# Altium schematic sheet halfBridge.SchDoc
size A
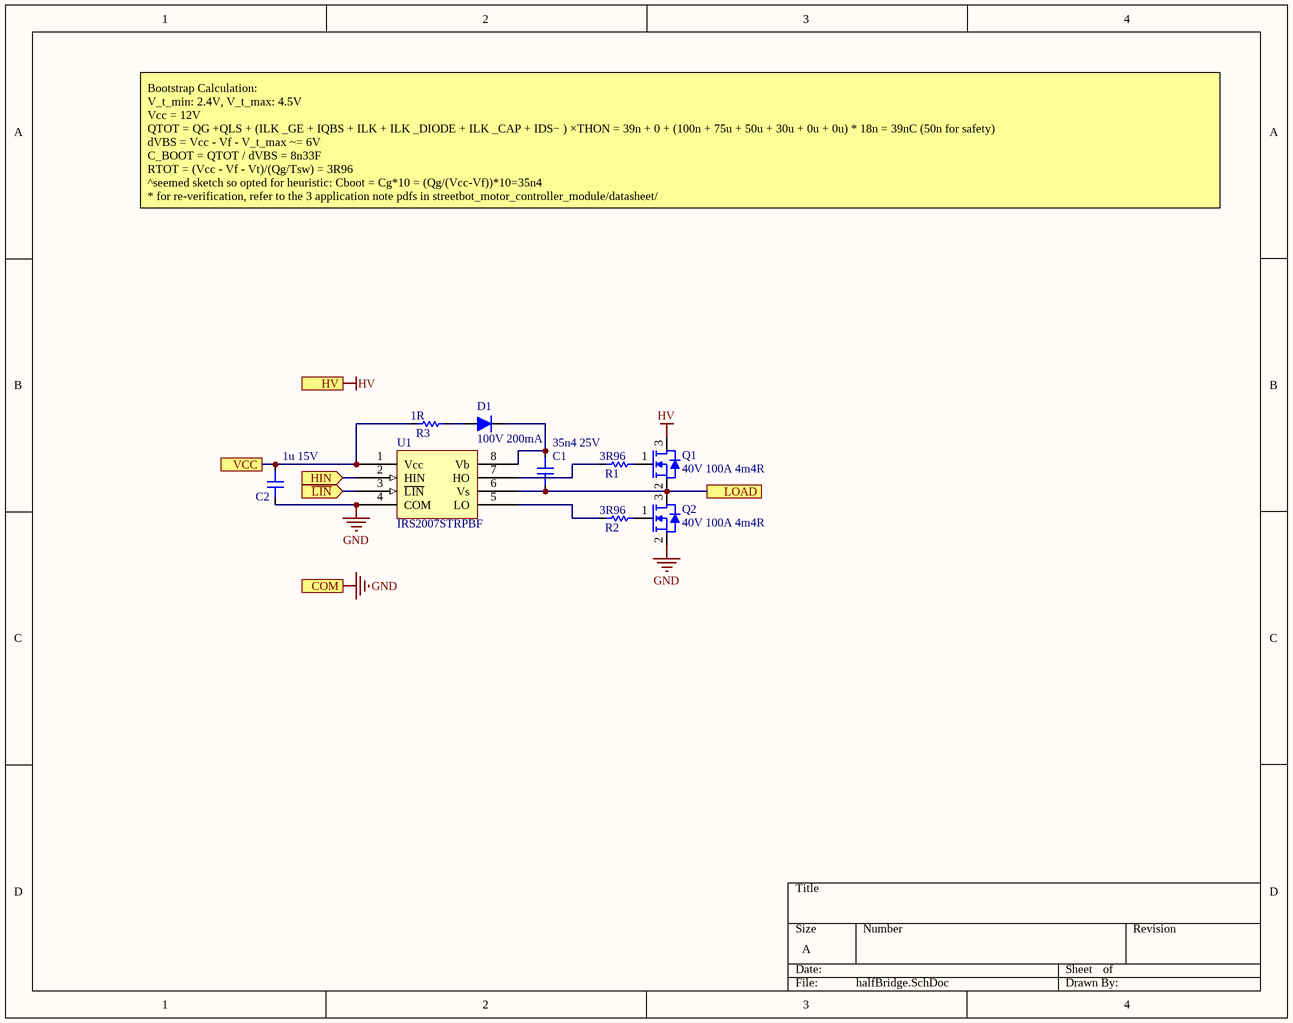
[diagram p0: halfBridge.SchDoc]

## Parts
C1  35n4 25V  [CAP 0805 L]
C2  1u 15V  [CAP 0805 L]
D1  100V 200mA  [SODFL250X100-2M]
Q1  40V 100A 4m4R  [DPAK127P600X120-5M (LFPAK56; Power-SO8)]
Q2  40V 100A 4m4R  [DPAK127P600X120-5M (LFPAK56; Power-SO8)]
R1  3R96  [RES 0603 L]
R2  3R96  [RES 0603 L]
R3  1R  [RES 0603 L]
U1  IRS2007STRPBF  [SOIC-8]

## Ports
COM, HIN (in), HV, LOAD, VCC, ~{LIN} (in)

## Nets
GND: C2.1 Q2.2 U1.4(COM) ; port COM
HV: Q1.3 ; port HV
HIN: U1.2(HIN) ; port HIN
~{LIN}: U1.3(~{LIN}) ; port ~{LIN}
LOAD: C1.1 Q1.2 Q2.3 U1.6(Vs) ; port LOAD
VCC: C2.2 R3.1 U1.1(Vcc) ; port VCC
NetC1_2: C1.2 D1.2 U1.8(Vb)
NetD1_1: D1.1 R3.2
NetQ1_1: Q1.1 R1.2
NetQ2_1: Q2.1 R2.2
NetR1_1: R1.1 U1.7(HO)
NetR2_1: R2.1 U1.5(LO)

## Notes on the sheet
- Bootstrap Calculation:
  V_t_min: 2.4V, V_t_max: 4.5V
  Vcc = 12V
  QTOT = QG +QLS + (ILK _GE + IQBS + ILK + ILK _DIODE + ILK _CAP + IDS− ) ×THON = 39n + 0 + (100n + 75u + 50u + 30u + 0u + 0u) * 18n = 39nC (50n for safety)
  dVBS = Vcc - Vf - V_t_max ~= 6V
  C_BOOT = QTOT / dVBS = 8n33F
  RTOT = (Vcc - Vf - Vt)/(Qg/Tsw) = 3R96
  ^seemed sketch so opted for heuristic: Cboot = Cg*10 = (Qg/(Vcc-Vf))*10=35n4
  * for re-verification, refer to the 3 application note pdfs in streetbot_motor_controller_module/datasheet/

## Library data of the parts
C1 C2 = CAP 0805
D1 = DIODE 100V 200mA: BAS16GWJ
Q1 Q2 = FET 40V 100A 4m4R: BUK7Y4R4-40EX
R1-R3 = RES 0603: 0603 RES
U1 = IC Half Bridge Driver